# EAGLE schematic SCK_DATA_BOARD_2.0_REV_05 (EAGLE 7.6.0)

## Sheet 1 of 3
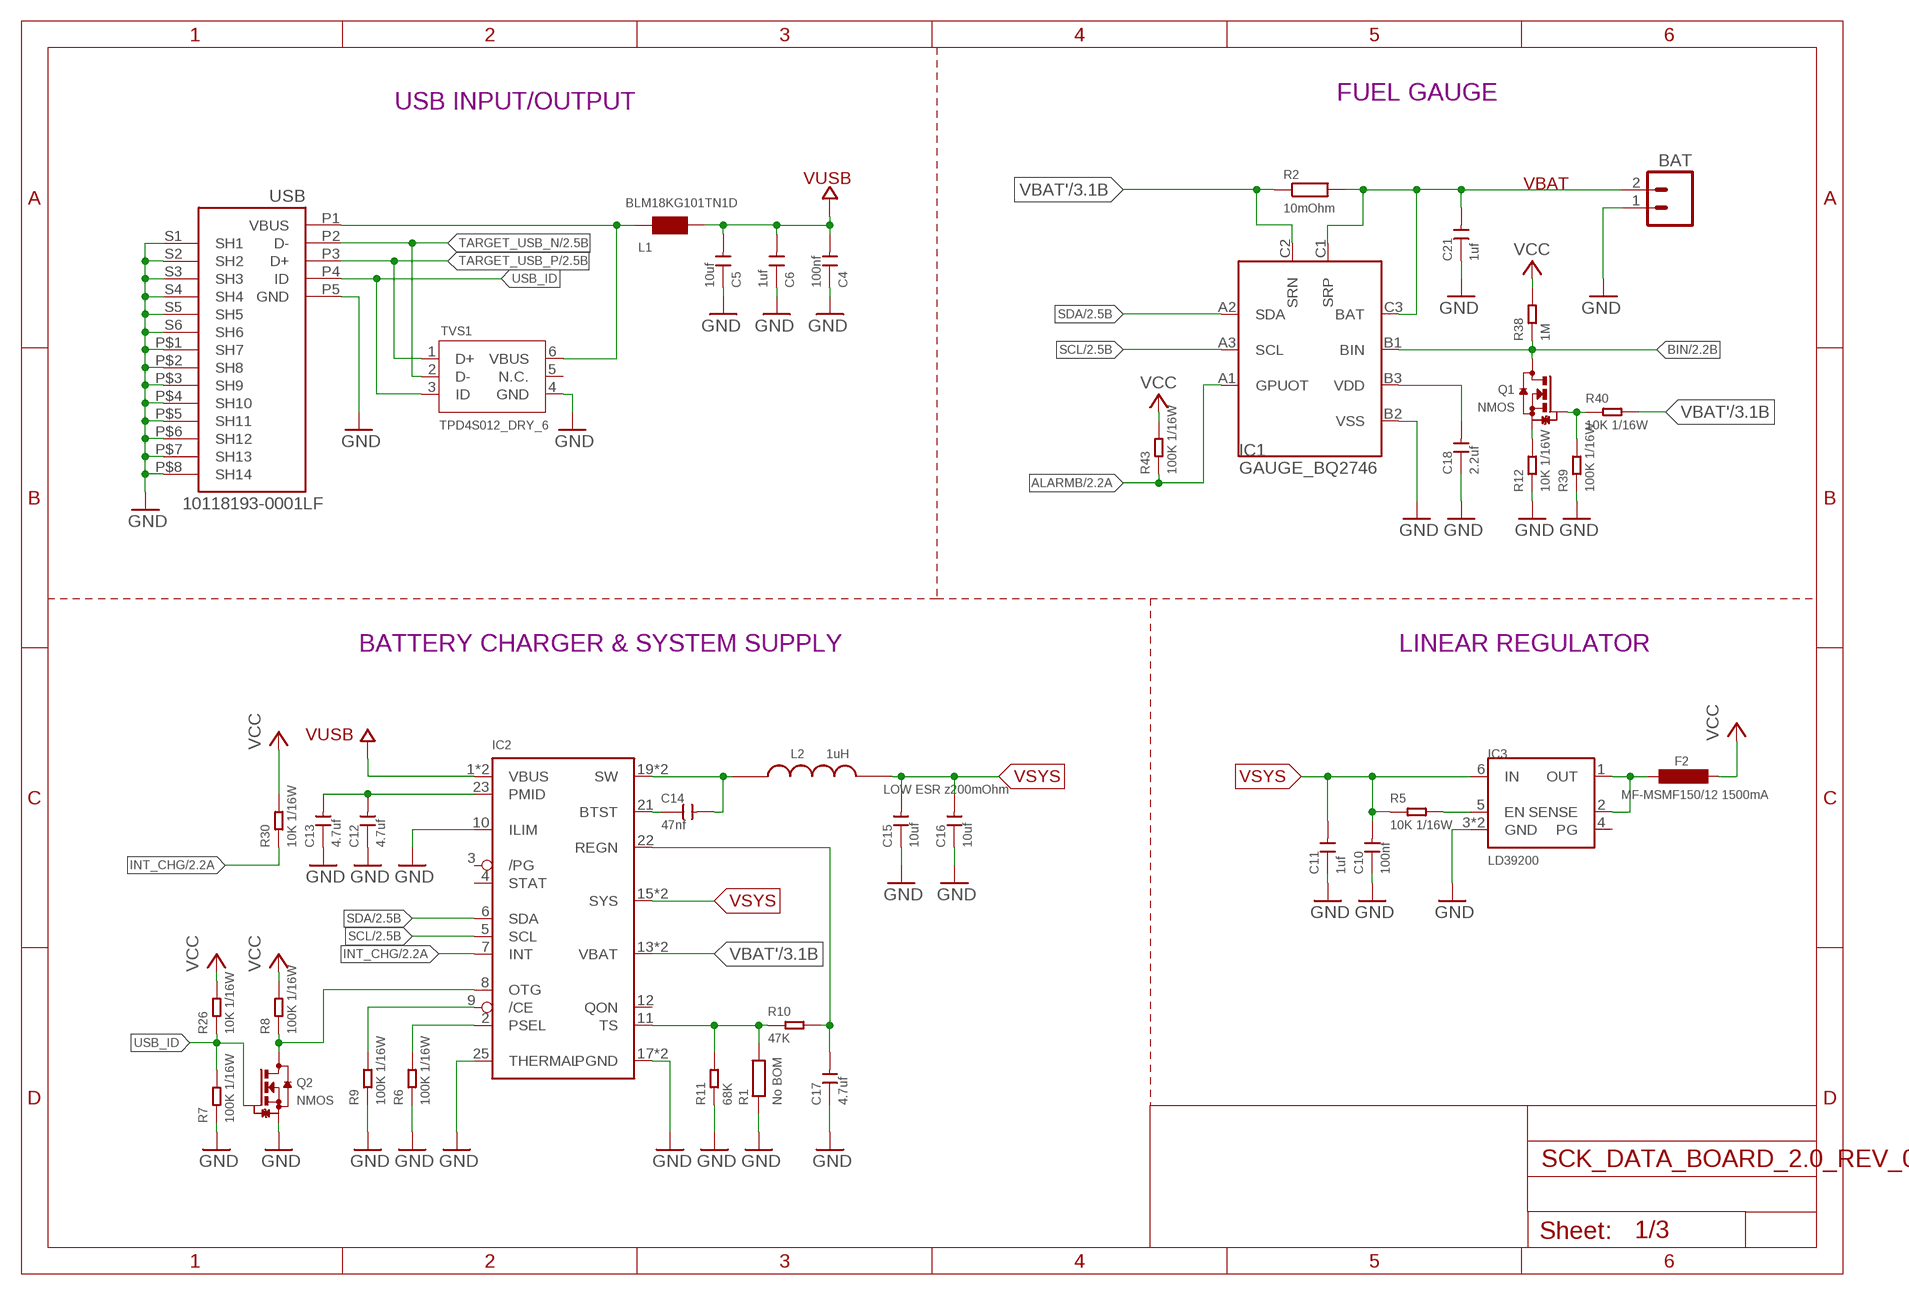
[diagram p0: schematic, sheet 1]

### Parts
BAT  M02-JST-2MM-SMT  [S2B-PH]
C4  100nf  CERAMIC-100NF-50V-10%-X7R(0805)  [C0805]
C5  10uf  CERAMIC-10UF-25V-10%-X5R(1206)  [C1206]
C6  1uf  CERAMIC-1UF-25V-10%-X7R(0805)  [C0805]
C10  100nf  CERAMIC-100NF-50V-10%-X7R(0603)  [C0603]
C11  1uf  CERAMIC-1UF-25V-10%-X7R(0805)  [C0805]
C12  4.7uf  CERAMIC-4.7UF-10V-10%-X5R(0603)  [C0603]
C13  4.7uf  CERAMIC-4.7UF-10V-10%-X5R(0603)  [C0603]
C14  47nf  CERAMIC-47NF-25V-10%-X7R(0402)  [C0402]
C15  10uf  CERAMIC-10UF-10V-10%-X5R(0603)  [C0603]
C16  10uf  CERAMIC-10UF-10V-10%-X5R(0603)  [C0603]
C17  4.7uf  CERAMIC-4.7UF-25V-10%-X5R(0805)  [C0805]
C18  2.2uf  CERAMIC-2.2UF-10V-10%-X7R(0603)  [C0603]
C21  1uf  CERAMIC-1UF-25V-10%-X7R(0805)  [C0805]
F2  MF-MSMF150/12 1500mA  L-EUL1812  [L1812]
IC1  GAUGE_BQ2746  [BGA-9]
IC2  BQ24259_VQFN(24)  [24-PIN_VQFN_THPAD]
IC3  LD39200  [DFN6_3X3MM]
L1  BLM18KG101TN1D  WUERTH-ELEKTRONIK_WE-CBF_0603  [WUERTH-ELEKTRONIK_0603]
L2  1uH  LQH32PN1R0NNCL  [HANGAR_C1210]
Q1  NMOS  NMOS_RJU003N03FRAT106  [NMOS_UMT3]
Q2  NMOS  NMOS_RJU003N03FRAT106  [NMOS_UMT3]
R1  No BOM  HANGAR_R-EU_R0402  [HANGAR_R0402]
R2  10mOhm  HANGAR_R-EU_R0603  [HANGAR_R0603]
R5  10K 1/16W  SMD-RES-10K-1%-1/16W(0402)  [R0402]
R6  100K 1/16W  SMD-RES-100K-5%-1/16W(0402)  [R0402]
R7  100K 1/16W  SMD-RES-100K-5%-1/16W(0402)  [R0402]
R8  100K 1/16W  SMD-RES-100K-5%-1/16W(0402)  [R0402]
R9  100K 1/16W  SMD-RES-100K-5%-1/16W(0402)  [R0402]
R10  47K  SMD-RES-47K-5%-1/16W(0402)  [R0402]
R11  68K  SMD-RES-68K-50V-5%(0402)  [R0402]
R12  10K 1/16W  SMD-RES-10K-1%-1/16W(0402)  [R0402]
R26  10K 1/16W  SMD-RES-10K-1%-1/16W(0402)  [R0402]
R30  10K 1/16W  SMD-RES-10K-1%-1/16W(0402)  [R0402]
R38  1M  SMD-RES-1M-5%-1/16W(0402)  [R0402]
R39  100K 1/16W  SMD-RES-100K-5%-1/16W(0402)  [R0402]
R40  10K 1/16W  SMD-RES-10K-1%-1/16W(0402)  [R0402]
R43  100K 1/16W  SMD-RES-100K-5%-1/16W(0402)  [R0402]
TVS1  TPD4S012_DRY_6  [DRY6]
USB  10118193-0001LF  HANGAR_MYCON2_USB-MINI-B  [HANGAR_CON2_USB_MICRO_B_AT]

### Nets
ALARMB: IC1.A1(GPUOT) R43.1 ; also sheet 2
BIN: IC1.B1(BIN) Q1.3(D) R38.1 ; also sheet 2
BTST: C14.1 IC2.21(BTST)
GND [gnd]: BAT.1 C4.1 C5.1 C6.1 C10.1 C11.1 C12.1 C13.1 C15.1 C16.1 C17.1 C18.1 C21.1 IC1.B2(VSS) IC2.10(ILIM) IC2.17(PGND) IC2.18(PGND) IC2.25(THERMAL) IC3.3(GND) IC3.7(GND) Q2.1(S) R1.1 R6.1 R7.1 R9.1 R11.1 R12.1 R39.1 TVS1.4(GND) USB.P5(GND) USB.P$1(SH7) USB.P$2(SH8) USB.P$3(SH9) USB.P$4(SH10) USB.P$5(SH11) USB.P$6(SH12) USB.P$7(SH13) USB.P$8(SH14) USB.S1(SH1) USB.S2(SH2) USB.S3(SH3) USB.S4(SH4) USB.S5(SH5) USB.S6(SH6) ; also sheet 2,3
INT_CHG: IC2.7(INT) R30.1 ; also sheet 2
N$1: IC3.5(EN) R5.2
N$9: C18.2 IC1.B3(VDD)
N$14: Q1.1(S) R12.2
N$17: C17.2 IC2.22(REGN) R10.2
N$19: C12.2 C13.2 IC2.23(PMID)
N$20: Q1.2(G) R39.2 R40.1
N$32: IC2.11(TS) R1.2 R10.1 R11.2
N$33: IC2.9(/CE) R9.2
OTG: IC2.8(OTG) Q2.3(D) R8.1
PSEL: IC2.2(PSEL) R6.2
SCL: IC1.A3(SCL) IC2.5(SCL) ; also sheet 2,3
SDA: IC1.A2(SDA) IC2.6(SDA) ; also sheet 2,3
SW: C14.2 IC2.19(SW) IC2.20(SW) L2.1
TARGET_USB_N [gnd]: TVS1.2(D-) USB.P2(D-) ; also sheet 2
TARGET_USB_P: TVS1.1(D+) USB.P3(D+) ; also sheet 2
USB_ID: Q2.2(G) R7.2 R26.1 TVS1.3(ID) USB.P4(ID)
V+1: L1.1 TVS1.6(VBUS) USB.P1(VBUS)
VBAT: BAT.2 C21.2 IC1.C1(SRP) IC1.C3(BAT) R2.2
VBAT': IC1.C2(SRN) IC2.13(VBAT) IC2.14(VBAT) R2.1 R40.2 ; also sheet 3
VCC [power]: F2.1 R8.2 R26.2 R30.2 R38.2 R43.2 ; also sheet 2,3
VCC_SOURCE: F2.2 IC3.1(OUT) IC3.2(SENSE)
VSYS [power]: C10.2 C11.2 C15.2 C16.2 IC2.15(SYS) IC2.16(SYS) IC3.6(IN) L2.2 R5.1
VUSB [power]: C4.2 C5.2 C6.2 IC2.1(VBUS) IC2.24(VBUS) L1.2
Unconnected: IC2.3(/PG) IC2.4(STAT) IC2.12(QON) IC3.4(PG) TVS1.5(N.C.)

### Notes on the sheet
- FUEL GAUGE
- USB INPUT/OUTPUT
- FUENTE DC 3.3V
- BATTERY CHARGER & SYSTEM SUPPLY | LINEAR REGULATOR
- LOW ESR z200mOhm

## Sheet 2 of 3
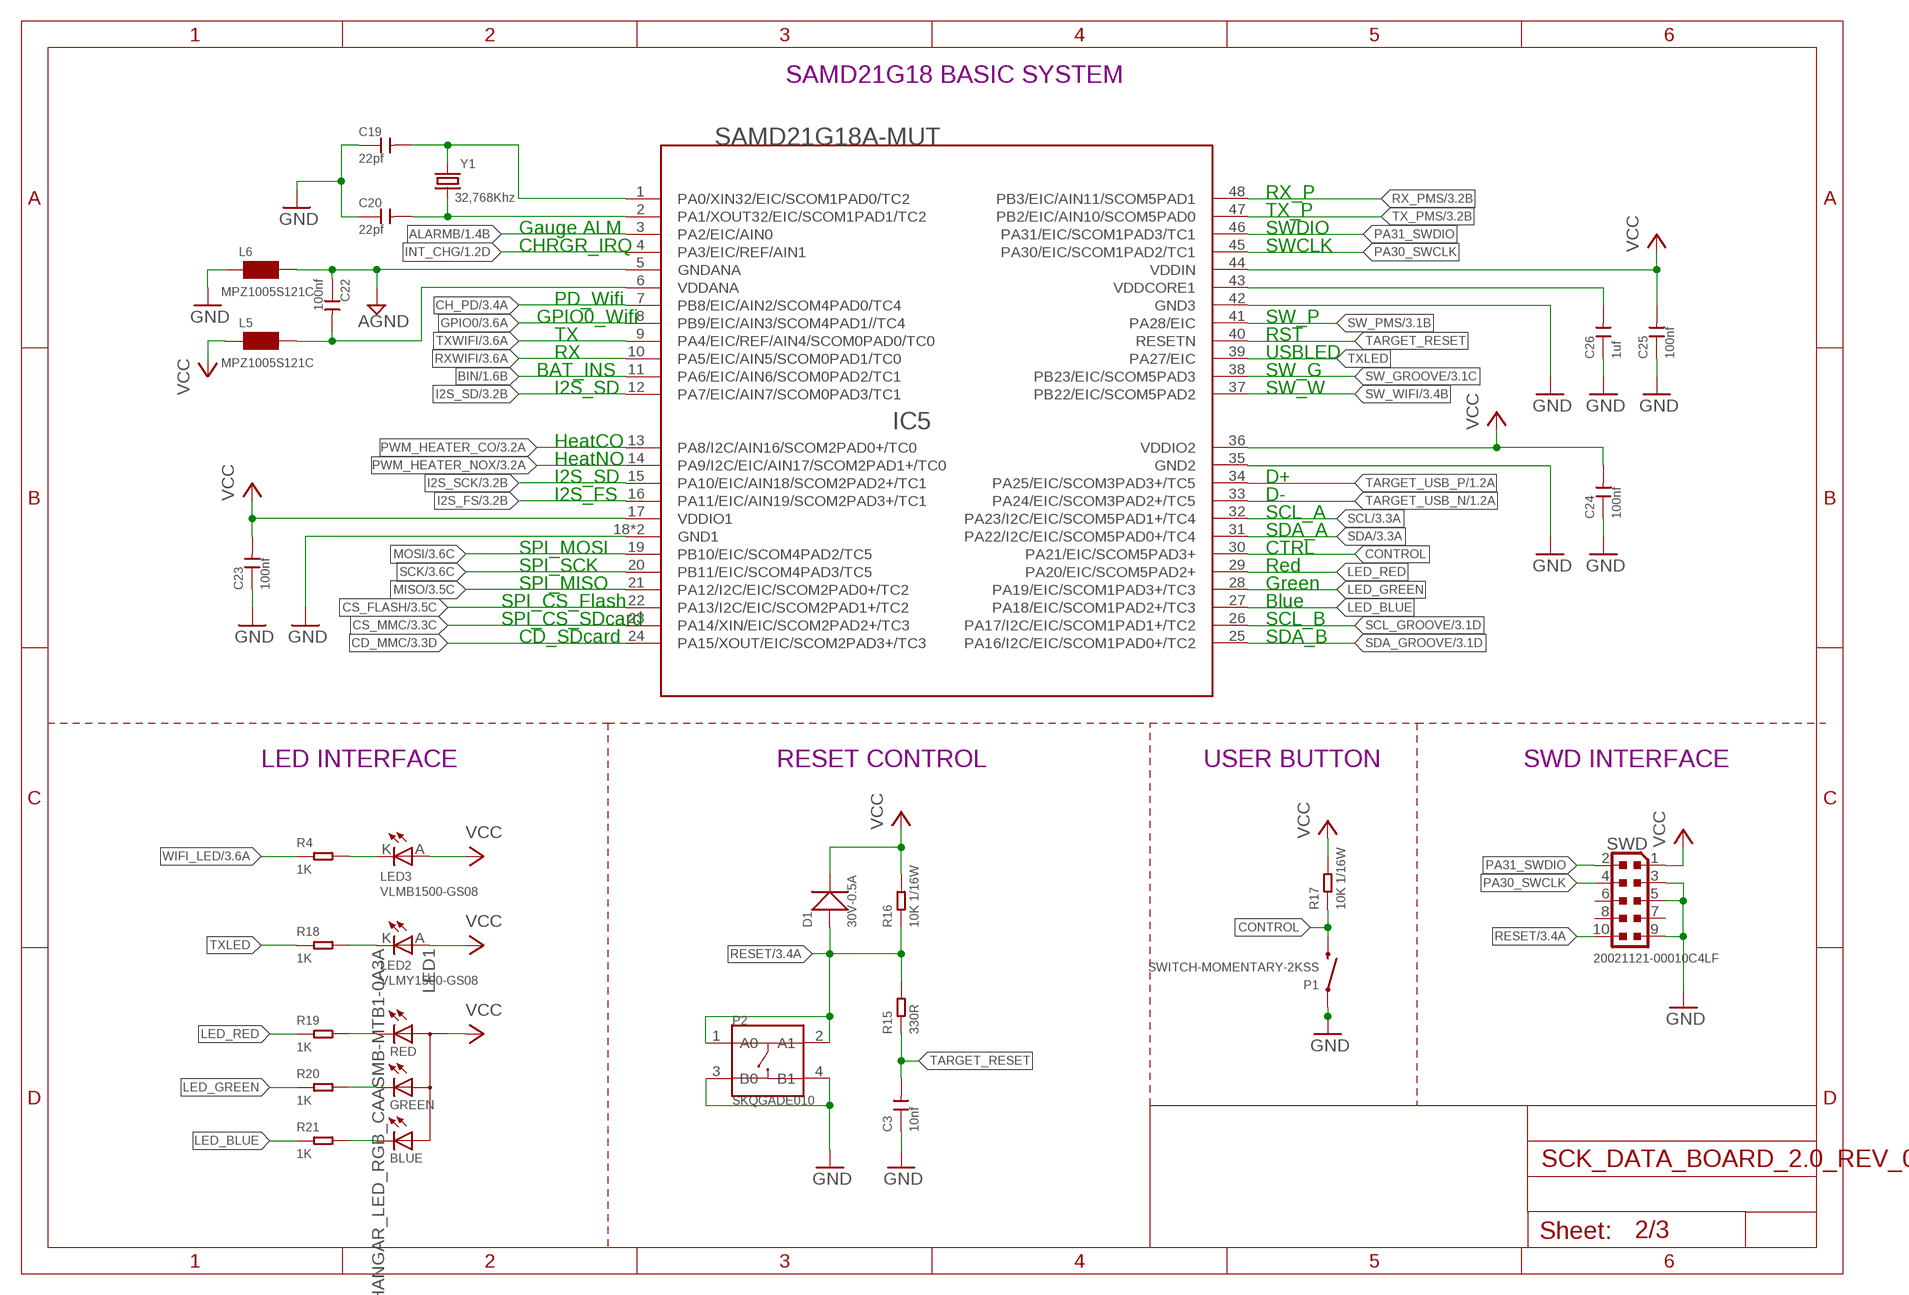
[diagram p1: schematic, sheet 2]

### Parts
C3  10nf  CERAMIC-10NF-50V-10%-X7R(0402)  [C0402]
C19  22pf  CERAMIC-22PF-50V-5%-NPO(0402)  [C0402]
C20  22pf  CERAMIC-22PF-50V-5%-NPO(0402)  [C0402]
C22  100nf  CERAMIC-100NF-25V-10%-X7R(0402)  [C0402]
C23  100nf  CERAMIC-100NF-25V-10%-X7R(0402)  [C0402]
C24  100nf  CERAMIC-100NF-25V-10%-X7R(0402)  [C0402]
C25  100nf  CERAMIC-100NF-25V-10%-X7R(0402)  [C0402]
C26  1uf  CERAMIC-1UF-10V-10%-X5R(0402)  [C0402]
D1  30V-0.5A  SMD-DIODE-SCHOTTKY-30V-0.5A(SOD-323)  [SOD-323]
IC5  SAMD21G18A-MUT  HANGAR_SAMD21G18A-MUT  [HANGAR_QFN48-7X7]
L5  MPZ1005S121C  WE-CBF_0402  [0402]
L6  MPZ1005S121C  WE-CBF_0402  [0402]
LED1  HANGAR_LED_RGB_CAASMB-MTB1-0A3A  [HANGAR_P-LCC-4]
LED2  VLMY1500-GS08  LED_SMALL  [DIODE_0402_R]
LED3  VLMB1500-GS08  LED_SMALL  [DIODE_0402_R]
P1  SWITCH-MOMENTARY-2KSS  [KSS241G]
P2  SKQGADE010  SMD-BUTTON(4P-5.2X5.2X1.5MM-SKQGADE010)-SKQGADE010  [SW4-SMD-5.2X5.2X1.5MM]
R4  1K  SMD-RES-1K-5%-1/16W(0402)  [R0402]
R15  330R  SMD-RES-330R-1%-1/16W(0402)  [R0402]
R16  10K 1/16W  SMD-RES-10K-1%-1/16W(0402)  [R0402]
R17  10K 1/16W  SMD-RES-10K-1%-1/16W(0402)  [R0402]
R18  1K  SMD-RES-1K-5%-1/16W(0402)  [R0402]
R19  1K  SMD-RES-1K-5%-1/16W(0402)  [R0402]
R20  1K  SMD-RES-1K-5%-1/16W(0402)  [R0402]
R21  1K  SMD-RES-1K-5%-1/16W(0402)  [R0402]
SWD  20021121-00010C4LF  PINHEAD_PINHD-2X5SMD  [2X05_SMD_1.27MM]
Y1  32,768Khz  0213_ABS07-32.768KHZ-T  [RESONATOR_EPSON_FC_145]

### Nets
AGND: C22.1 IC5.5(GNDANA) L6.2
ALARMB: IC5.3(PA2/EIC/AIN0) ; also sheet 1
AVCC: C22.2 IC5.6(VDDANA) L5.2
BIN: IC5.11(PA6/EIC/AIN6/SCOM0PAD2/TC1) ; also sheet 1
CD_MMC: IC5.24(PA15/XOUT/EIC/SCOM2PAD3+/TC3) ; also sheet 3
CH_PD: IC5.7(PB8/EIC/AIN2/SCOM4PAD0/TC4) ; also sheet 3
CONTROL: IC5.30(PA21/EIC/SCOM5PAD3+) P1.2 R17.1
CS_FLASH: IC5.22(PA13/I2C/EIC/SCOM2PAD1+/TC2) ; also sheet 3
CS_MMC: IC5.23(PA14/XIN/EIC/SCOM2PAD2+/TC3) ; also sheet 3
GND [gnd]: C3.1 C19.1 C20.1 C23.1 C24.1 C25.1 C26.1 IC5.18(GND1) IC5.35(GND2) IC5.42(GND3) IC5.TP(GND1) L6.1 P1.1 P2.3(B0) P2.4(B1) SWD.3 SWD.5 SWD.9 ; also sheet 1,3
GPIO0: IC5.8(PB9/EIC/AIN3/SCOM4PAD1//TC4) ; also sheet 3
I2S_FS: IC5.16(PA11/EIC/AIN19/SCOM2PAD3+/TC1) ; also sheet 3
I2S_SCK: IC5.15(PA10/EIC/AIN18/SCOM2PAD2+/TC1) ; also sheet 3
I2S_SD: IC5.12(PA7/EIC/AIN7/SCOM0PAD3/TC1) ; also sheet 3
INT_CHG: IC5.4(PA3/EIC/REF/AIN1) ; also sheet 1
LED_BLUE: IC5.27(PA18/EIC/SCOM1PAD2+/TC3) R21.1
LED_GREEN: IC5.28(PA19/EIC/SCOM1PAD3+/TC3) R20.1
LED_RED: IC5.29(PA20/EIC/SCOM5PAD2+) R19.1
MISO: IC5.21(PA12/I2C/EIC/SCOM2PAD0+/TC2) ; also sheet 3
MOSI: IC5.19(PB10/EIC/SCOM4PAD2/TC5) ; also sheet 3
N$2 [usbvcc]: LED2.K R18.2
N$7: LED1.2(GREEN) R20.2
N$8: LED3.K R4.2
N$10: LED1.1(RED) R19.2
N$11: LED1.3(BLUE) R21.2
PA00_XIN32: C19.2 IC5.1(PA0/XIN32/EIC/SCOM1PAD0/TC2) Y1.P$2
PA01_XOUT32: C20.2 IC5.2(PA1/XOUT32/EIC/SCOM1PAD1/TC2) Y1.P$1
PA30_SWCLK: IC5.45(PA30/EIC/SCOM1PAD2/TC1) SWD.4
PA31_SWDIO: IC5.46(PA31/EIC/SCOM1PAD3/TC1) SWD.2
PWM_HEATER_CO: IC5.13(PA8/I2C/AIN16/SCOM2PAD0+/TC0) ; also sheet 3
PWM_HEATER_NOX: IC5.14(PA9/I2C/EIC/AIN17/SCOM2PAD1+/TC0) ; also sheet 3
RESET: D1.+ P2.1(A0) P2.2(A1) R15.2 R16.1 SWD.10 ; also sheet 3
RX_PMS: IC5.48(PB3/EIC/AIN11/SCOM5PAD1) ; also sheet 3
RXWIFI: IC5.10(PA5/EIC/AIN5/SCOM0PAD1/TC0) ; also sheet 3
SCK: IC5.20(PB11/EIC/SCOM4PAD3/TC5) ; also sheet 3
SCL: IC5.32(PA23/I2C/EIC/SCOM5PAD1+/TC4) ; also sheet 1,3
SCL_GROOVE: IC5.26(PA17/I2C/EIC/SCOM1PAD1+/TC2) ; also sheet 3
SDA: IC5.31(PA22/I2C/EIC/SCOM5PAD0+/TC4) ; also sheet 1,3
SDA_GROOVE: IC5.25(PA16/I2C/EIC/SCOM1PAD0+/TC2) ; also sheet 3
SW_GROOVE: IC5.38(PB23/EIC/SCOM5PAD3) ; also sheet 3
SW_PMS: IC5.41(PA28/EIC) ; also sheet 3
SW_WIFI: IC5.37(PB22/EIC/SCOM5PAD2) ; also sheet 3
TARGET_RESET: C3.2 IC5.40(RESETN) R15.1
TARGET_USB_N [gnd]: IC5.33(PA24/EIC/SCOM3PAD2+/TC5) ; also sheet 1
TARGET_USB_P: IC5.34(PA25/EIC/SCOM3PAD3+/TC5) ; also sheet 1
TX_PMS: IC5.47(PB2/EIC/AIN10/SCOM5PAD0) ; also sheet 3
TXLED: IC5.39(PA27/EIC) R18.1
TXWIFI: IC5.9(PA4/EIC/REF/AIN4/SCOM0PAD0/TC0) ; also sheet 3
VCC [power]: C23.2 C24.2 C25.2 D1.- IC5.17(VDDIO1) IC5.36(VDDIO2) IC5.44(VDDIN) L5.1 LED1.4(A) LED2.A LED3.A R16.2 R17.2 SWD.1 ; also sheet 1,3
VDDCORE: C26.2 IC5.43(VDDCORE1)
WIFI_LED: R4.1 ; also sheet 3
Unconnected: SWD.6 SWD.7 SWD.8

### Notes on the sheet
- SAMD21G18 BASIC SYSTEM
- RX_P
- TX_P
- Gauge ALM | SWDIO
- CHRGR_IRQ | SWCLK
- PD_Wifi
- GPIO0_Wifi | SW_P
- TX | RST
- RX | USBLED
- BAT_INS | SW_G
- I2S_SD | SW_W
- HeatCO
- HeatNO
- I2S_SD | D+
- I2S_FS | D-
- SCL_A
- SDA_A
- SPI_MOSI | CTRL
- SPI_SCK | Red
- SPI_MISO | Green
- SPI_CS_Flash | Blue
- SPI_CS_SDcard | SCL_B
- CD_SDcard | SDA_B
- PROGRAMADOR USB
- LED INTERFACE | RESET CONTROL | USER BUTTON | SWD INTERFACE

## Sheet 3 of 3
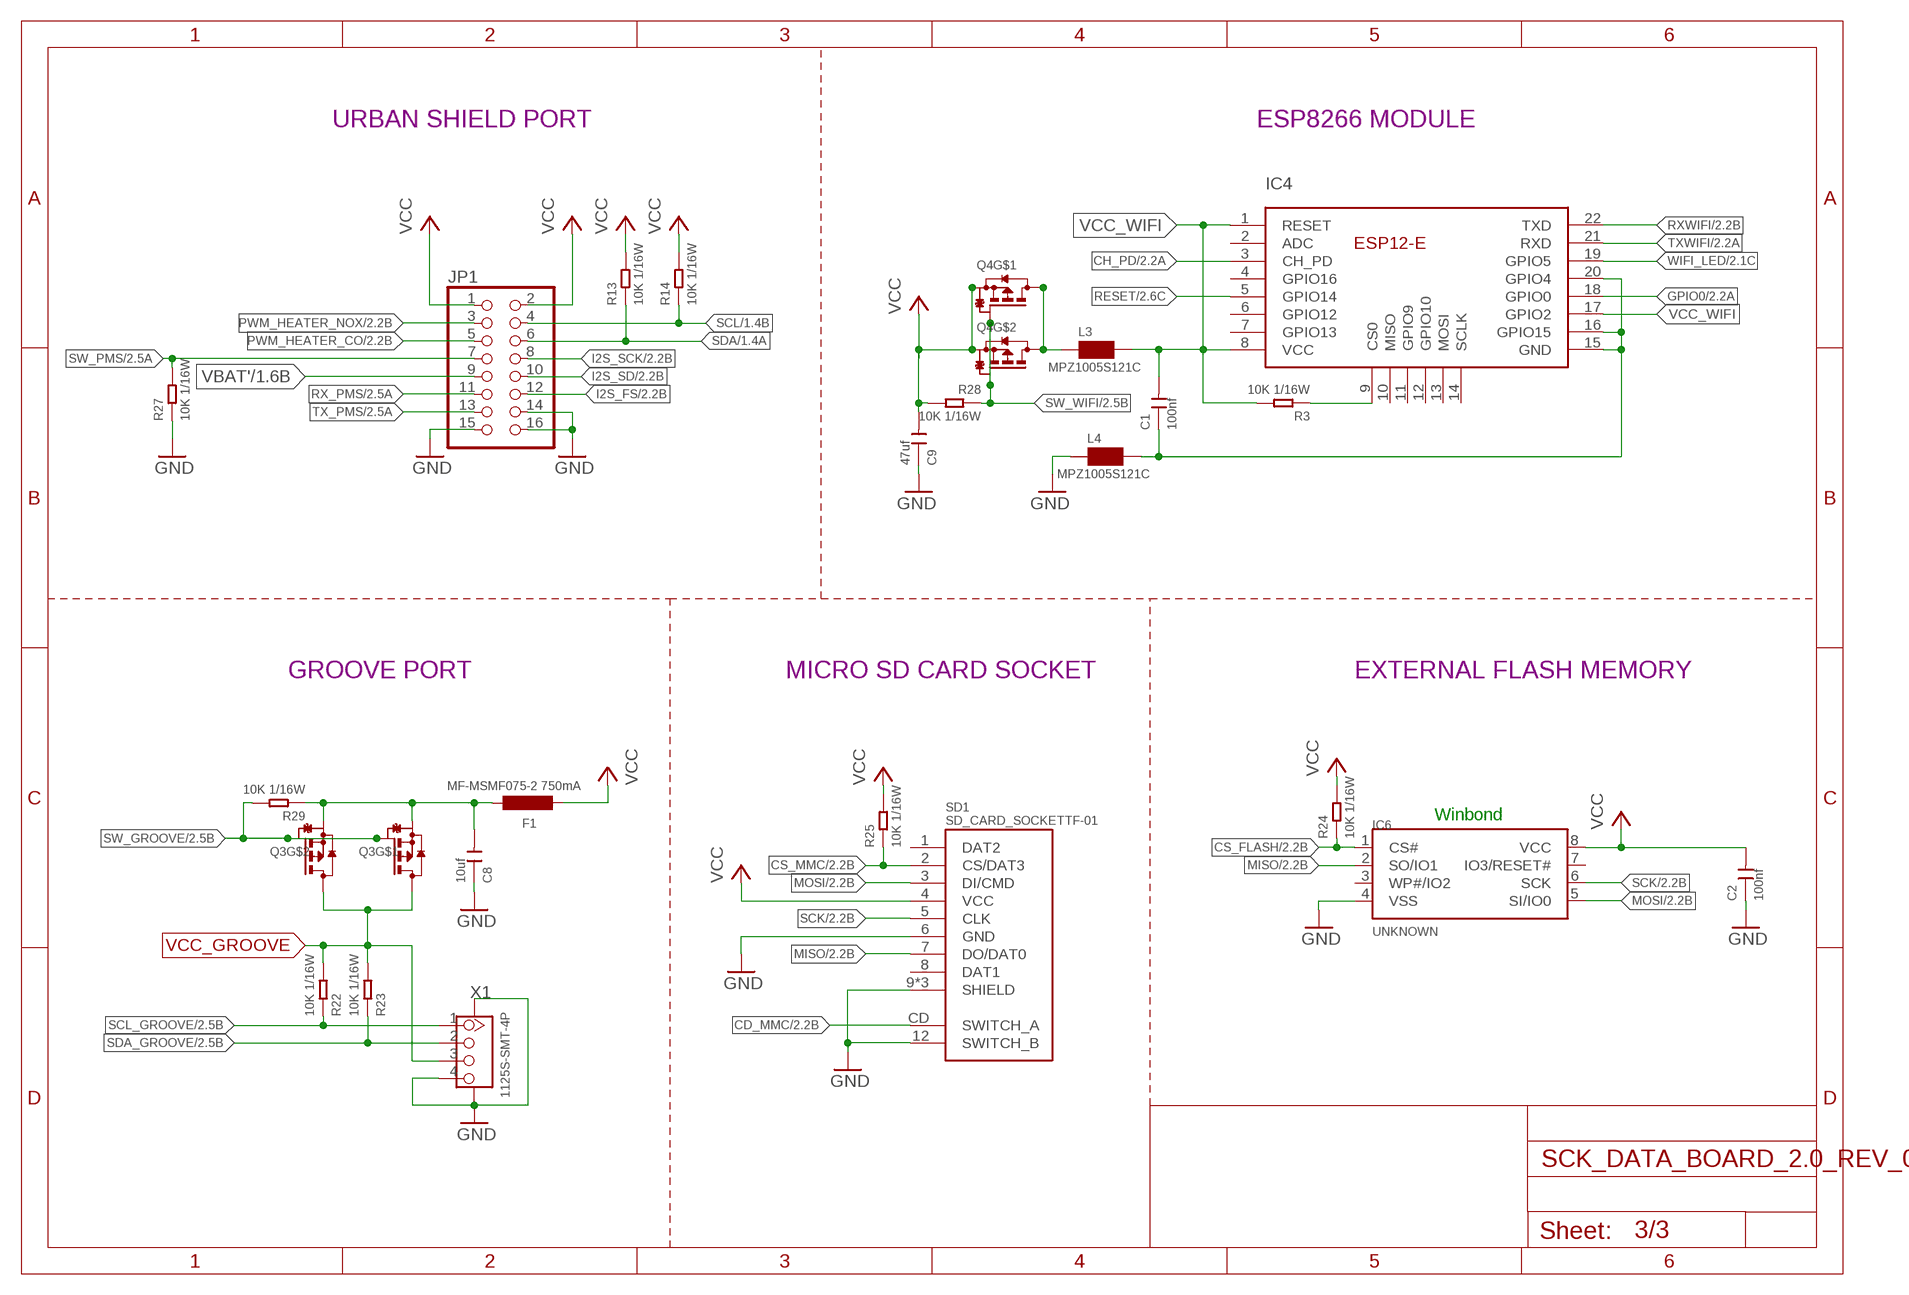
[diagram p2: schematic, sheet 3]

### Parts
C1  100nf  CERAMIC-100NF-25V-10%-X7R(0402)  [C0402]
C2  100nf  CERAMIC-100NF-25V-10%-X7R(0402)  [C0402]
C8  10uf  CERAMIC-10UF-25V-10%-X5R(1206)  [C1206]
C9  47uf  CERAMIC-47UF-10V-20%-X7R(1210)  [C1210]
F1  MF-MSMF075-2 750mA  L-EUL1812  [L1812]
IC4  HANGAR_ESP-12-E  [HANGAR_ESP12-E]
IC6  UNKNOWN  FLASH_S25FL064L  [SOIC_8-208MILS]
JP1  PINHD_2X8FEM_SMD  [PINHD_2X8_SMD_FEMALE_UNHOLED]
L3  MPZ1005S121C  WE-CBF_0402  [0402]
L4  MPZ1005S121C  WE-CBF_0402  [0402]
Q3  PMOS  MOSFETP_BOTH  [HANGAR_POWERPAKSC70-6L]
Q4  PMOS  MOSFETP_BOTH  [HANGAR_POWERPAKSC70-6L]
R3  10K 1/16W  SMD-RES-10K-1%-1/16W(0402)  [R0402]
R13  10K 1/16W  SMD-RES-10K-1%-1/16W(0402)  [R0402]
R14  10K 1/16W  SMD-RES-10K-1%-1/16W(0402)  [R0402]
R22  10K 1/16W  SMD-RES-10K-1%-1/16W(0402)  [R0402]
R23  10K 1/16W  SMD-RES-10K-1%-1/16W(0402)  [R0402]
R24  10K 1/16W  SMD-RES-10K-1%-1/16W(0402)  [R0402]
R25  10K 1/16W  SMD-RES-10K-1%-1/16W(0402)  [R0402]
R27  10K 1/16W  SMD-RES-10K-1%-1/16W(0402)  [R0402]
R28  10K 1/16W  SMD-RES-10K-1%-1/16W(0402)  [R0402]
R29  10K 1/16W  SMD-RES-10K-1%-1/16W(0402)  [R0402]
SD1  SD_CARD_SOCKETTF-01  [TF-01]
X1  1125S-SMT-4P  GROVE-CONNECTOR-SMD'DD'  [HW4-SMD-2.0]

### Nets
CD_MMC: SD1.CD(SWITCH_A) ; also sheet 2
CH_PD: IC4.3(CH_PD) ; also sheet 2
CS_FLASH: IC6.1(CS#) R24.1 ; also sheet 2
CS_MMC: R25.1 SD1.2(CS/DAT3) ; also sheet 2
GND [gnd]: C2.1 C8.1 C9.1 IC6.4(VSS) JP1.14 JP1.15 JP1.16 L4.2 R27.1 SD1.6(GND) SD1.9(SHIELD) SD1.10(SHIELD) SD1.11(SHIELD) SD1.12(SWITCH_B) X1.4 X1.SS1 X1.SS2 ; also sheet 1,2
GND_WIFI: C1.1 IC4.15(GND) IC4.16(GPIO15) IC4.20(GPIO4) L4.1
GPIO0: IC4.18(GPIO0) ; also sheet 2
I2S_FS: JP1.12 ; also sheet 2
I2S_SCK: JP1.8 ; also sheet 2
I2S_SD: JP1.10 ; also sheet 2
MISO: IC6.2(SO/IO1) SD1.7(DO/DAT0) ; also sheet 2
MOSI: IC6.5(SI/IO0) SD1.3(DI/CMD) ; also sheet 2
N$3: L3.2 Q4.3(D) Q4.6(D) Q4.TP1(D) Q4.TP2(D)
N$13: IC4.9(CS0) R3.1
PWM_HEATER_CO: JP1.5 ; also sheet 2
PWM_HEATER_NOX: JP1.3 ; also sheet 2
RESET: IC4.5(GPIO14) ; also sheet 2
RX_PMS: JP1.11 ; also sheet 2
RXWIFI: IC4.22(TXD) ; also sheet 2
SCK: IC6.6(SCK) SD1.5(CLK) ; also sheet 2
SCL: JP1.4 R14.1 ; also sheet 1,2
SCL_GROOVE: R22.1 X1.1 ; also sheet 2
SDA: JP1.6 R13.1 ; also sheet 1,2
SDA_GROOVE: R23.1 X1.2 ; also sheet 2
SW_GROOVE: Q3.2(G) Q3.5(G) R29.2 ; also sheet 2
SW_PMS: JP1.7 R27.2 ; also sheet 2
SW_WIFI: Q4.2(G) Q4.5(G) R28.1 ; also sheet 2
TX_PMS: JP1.13 ; also sheet 2
TXWIFI: IC4.21(RXD) ; also sheet 2
VBAT': JP1.9 ; also sheet 1
VCC [power]: C2.2 C9.2 F1.2 IC6.8(VCC) JP1.1 JP1.2 Q4.1(S) Q4.4(S) R13.2 R14.2 R24.2 R25.2 R28.2 SD1.4(VCC) ; also sheet 1,2
VCC_GROOVE [power]: Q3.3(D) Q3.6(D) Q3.TP1(D) Q3.TP2(D) R22.2 R23.2 X1.3
VCC_GROOVE_0: C8.2 F1.1 Q3.1(S) Q3.4(S) R29.1
VCC_WIFI: C1.2 IC4.1(RESET) IC4.8(VCC) IC4.17(GPIO2) L3.1 R3.2
WIFI_LED: IC4.19(GPIO5) ; also sheet 2
Unconnected: IC4.2(ADC) IC4.4(GPIO16) IC4.6(GPIO12) IC4.7(GPIO13) IC4.10(MISO) IC4.11(GPIO9) IC4.12(GPIO10) IC4.13(MOSI) IC4.14(SCLK) IC6.3(WP#/IO2) IC6.7(IO3/RESET#) SD1.1(DAT2) SD1.8(DAT1)

### Notes on the sheet
- MODULO INALAMBRICO
- SD CARD
- URBAN SHIELD PORT | ESP8266 MODULE
- GROOVE PORT | MICRO SD CARD SOCKET | EXTERNAL FLASH MEMORY
- Winbond

## Library data of the parts
BAT = SparkFun:M02: Header 2 Standard 2-pin 0.1" header. Use with straight break away headers (SKU : PRT-00116), right angle break away headers (PRT-00553), swiss pins (PRT-00743), machine pins (PRT-00117), and female headers (PRT-00115). Molex polarized connector foot print use with SKU : PRT-08233 with associated crimp pins and housings.
C1 C2 C22-C25 = Seeed-OPL-Capacitor:CERAMIC-100NF-25V-10%-X7R(0402): 302010024; MPN: CC0402KRX7R8BB104
C3 = Seeed-OPL-Capacitor:CERAMIC-10NF-50V-10%-X7R(0402): 302010006; MPN: CC0402KRX7R9BB103
C4 = Seeed-OPL-Capacitor:CERAMIC-100NF-50V-10%-X7R(0805): 302010165; MPN: CC0805KRX7R9BB104
C5 C8 = Seeed-OPL-Capacitor:CERAMIC-10UF-25V-10%-X5R(1206): 302010181; MPN: CC1206KKX5R8BB106
C6 C11 C21 = Seeed-OPL-Capacitor:CERAMIC-1UF-25V-10%-X7R(0805): 302010179; MPN: CC0805KKX7R8BB105
C9 = Seeed-OPL-Capacitor:CERAMIC-47UF-10V-20%-X7R(1210): 302010252; MPN: GRM32ER71A476ME15L
C10 = Seeed-OPL-Capacitor:CERAMIC-100NF-50V-10%-X7R(0603): 302010138; MPN: CC0603KRX7R9BB104
C12 C13 = Seeed-OPL-Capacitor:CERAMIC-4.7UF-10V-10%-X5R(0603): 302010111; MPN: CC0603KRX5R6BB475
C14 = Seeed-OPL-Capacitor:CERAMIC-47NF-25V-10%-X7R(0402): 302010002; MPN: CC0402KRX7R8BB473
C15 C16 = Seeed-OPL-Capacitor:CERAMIC-10UF-10V-10%-X5R(0603): 302010103; MPN: CC0603KRX5R6BB106
C17 = Seeed-OPL-Capacitor:CERAMIC-4.7UF-25V-10%-X5R(0805): 302010146; MPN: CC0805KKX5R8BB475
C18 = Seeed-OPL-Capacitor:CERAMIC-2.2UF-10V-10%-X7R(0603): 302010054; MPN: CC0603KRX7R6BB225
C19 C20 = Seeed-OPL-Capacitor:CERAMIC-22PF-50V-5%-NPO(0402): 302010018; MPN: CC0402JRNPO9BN220
C26 = Seeed-OPL-Capacitor:CERAMIC-1UF-10V-10%-X5R(0402): 302010040; MPN: CC0402KRX5R6BB105
D1 = Seeed-OPL-Diode:SMD-DIODE-SCHOTTKY-30V-0.5A(SOD-323): 304020004; MPN: LRB551V-30T1G
F1 F2 = rcl:L-EU: INDUCTOR, European symbol
IC1 = SCK_URBAN_SHIELD_v1.6:GAUGE_BQ2746
IC2 = SCK_BASE_BOARD_v1.6:BQ24259_VQFN(24)
IC3 = SCK_BASE_BOARD_v1.6:LD39200
IC4 = SCK_BASE_BOARD_v1.6:HANGAR_ESP-12-E
IC5 = SCK_BASE_BOARD_v1.6:HANGAR_SAMD21G18A-: Atmel D21 32bit ARM Cortex-M0 microcontroller - 48 PIN TQFP 256KB flash memory + 32KB SRAM
IC6 = SCK_BASE_BOARD_v1.6:FLASH_S25FL064L
JP1 = SCK_S_v1.0:PINHD_2X8
L1 = SCK_BASE_BOARD_v1.6:WUERTH-ELEKTRONIK_WE-CBF: SMD EMI Suppression Ferrite Beads - excellent anti-EMI properties - low DCR - impedances till 3000 ohms - rated current up to 6 A
L2 = SCK_BASE_BOARD_v1.6:LQH32PN1R0NNCL
L3-L6 = wuerth-elektronik:WE-CBF: SMD EMI Suppression Ferrite Beads - excellent anti-EMI properties - low DCR - impedances till 3000 ohms - rated current up to 6 A
LED1 = SCK_BASE_BOARD_v2:HANGAR_LED_RGB_CA: PLCC-4 RGB LED
LED2 LED3 = SCK_BASE_BOARD_v1.6:LED_SMALL
P1 = Hangar:SWITCH-MOMENTARY-2
P2 = Seeed-Switch:SMD-BUTTON(4P-5.2X5.2X1.5MM-SKQGADE010): 311020017; MPN: SKQGADE010
Q1 Q2 = SCK_BASE_BOARD_v1.6:NMOS_RJU003N03FRAT106
Q3 Q4 = SCK_BASE_BOARD_v1.6:MOSFETP_BOTH
R1 = SCK_BASE_BOARD_v1.6:HANGAR_R-EU_: RESISTOR, European symbol
R2 = SCK_URBAN_SHIELD_v1.6:HANGAR_R-EU_: RESISTOR, European symbol
R3 R5 R12-R14 R16 R17 R22-R26 R30 R40 = Seeed-OPL-Resistor:SMD-RES-10K-1%-1/16W(0402): 301010047; MPN: RC0402FR-0710KL
R4 R18-R21 = Seeed-OPL-Resistor:SMD-RES-1K-5%-1/16W(0402): 301010006; MPN: RC0402JR-071KL
R6-R9 = Seeed-OPL-Resistor:SMD-RES-100K-5%-1/16W(0402): 301010033; MPN: RC0402JR-07100KL
R10 = Seeed-OPL-Resistor:SMD-RES-47K-5%-1/16W(0402): 301010005; MPN: RC0402JR-0747KL
R11 = Seeed-OPL-Resistor:SMD-RES-68K-50V-5%(0402): 301010496; MPN: RC0402JR-0768KL
R15 = Seeed-OPL-Resistor:SMD-RES-330R-1%-1/16W(0402): 301010466; MPN: RC0402FR-07330RL
R27-R29 = Seeed-Resistor:SMD-RES-10K-1%-1/16W(0402): 301010047; MPN: RC0402FR-0710KL
R38 = Seeed-Resistor:SMD-RES-1M-5%-1/16W(0402): 301010009; MPN: RC0402JR-071ML
R39 R43 = Seeed-Resistor:SMD-RES-100K-5%-1/16W(0402): 301010033; MPN: RC0402JR-07100KL
SD1 = Hangar:SD_CARD_SOCKET: SD/MMC Socket Media socket for SD and MMC cards. Push-push type. Model MOLEX 503182-0853
SWD = Hangar:PINHEAD_PINHD-2X5: PIN HEADER
TVS1 = fabhack:TPD4S012_DRY_6
USB = SCK_BASE_BOARD_v1.6:HANGAR_MYCON2_USB-MINI-B
X1 = Connector-new:GROVE-CONNECTOR-SMD: 4P-SMD-2.0:320110030;4P-SMD-2.0-90D:320110032
Y1 = Cristalli:0213_ABS07-32.768KHZ-T: 32,768KHz - SMD; MONTHLY_USAGE: _____; PART_NUMBER: ABS07-32.768KHZ-T; PRICE: _____; SUPPLIER: _____; TYPE: Cristalli; VALUE: 32,768Khz_SMD

## Net classes
2 gnd: width 0.254 mm, drill 0.254 mm, clearance 0.178 mm
3 usbvcc: width 0.203 mm, drill 0.406 mm, clearance 0.178 mm
4 USBpair: width 0.254 mm, drill 0.406 mm, clearance 0.406 mm